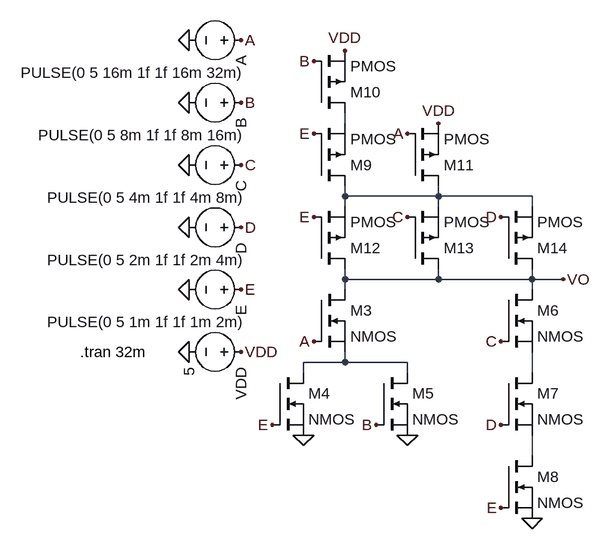
[diagram p0: schematic 21-16-11-a-1.asc]
21-16-11-a-1.asc, the LTspice schematic file:
Version 4
SHEET 1 1076 680
WIRE 640 -96 640 -112
WIRE 640 16 640 0
WIRE 784 16 784 0
WIRE 784 16 640 16
WIRE 928 16 784 16
WIRE 640 32 640 16
WIRE 784 32 784 16
WIRE 928 32 928 16
WIRE 640 144 640 128
WIRE 784 144 784 128
WIRE 784 144 640 144
WIRE 928 144 928 128
WIRE 928 144 784 144
WIRE 976 144 928 144
WIRE 640 160 640 144
WIRE 928 160 928 144
WIRE 640 272 640 256
WIRE 640 272 576 272
WIRE 736 272 640 272
WIRE 576 288 576 272
WIRE 736 288 736 272
WIRE 928 288 928 256
WIRE 928 416 928 384
FLAG 400 160 0
FLAG 480 160 E
FLAG 400 256 0
FLAG 480 256 VDD
FLAG 880 240 C
FLAG 880 368 D
FLAG 592 240 A
FLAG 688 368 B
FLAG 576 384 0
FLAG 736 384 0
FLAG 928 512 0
FLAG 880 48 D
FLAG 736 48 C
FLAG 784 -96 VDD
FLAG 592 -192 B
FLAG 736 -80 A
FLAG 400 64 0
FLAG 480 64 D
FLAG 400 -32 0
FLAG 480 -32 C
FLAG 400 -128 0
FLAG 480 -128 B
FLAG 400 -224 0
FLAG 480 -224 A
FLAG 976 144 VO
FLAG 640 -208 VDD
FLAG 880 496 E
FLAG 528 368 E
FLAG 592 48 E
FLAG 592 -80 E
SYMBOL voltage 496 160 R90
WINDOW 3 50 11 VRight 2
WINDOW 123 0 0 Left 0
WINDOW 39 0 0 Left 0
SYMATTR Value PULSE(0 5 1m 1f 1f 1m 2m)
SYMATTR InstName E
SYMBOL voltage 496 256 R90
WINDOW 123 0 0 Left 0
WINDOW 39 0 0 Left 0
SYMATTR InstName VDD
SYMATTR Value 5
SYMBOL nmos 592 160 R0
SYMATTR InstName M3
SYMBOL nmos 528 288 R0
SYMATTR InstName M4
SYMBOL nmos 688 288 R0
SYMATTR InstName M5
SYMBOL nmos 880 160 R0
SYMATTR InstName M6
SYMBOL nmos 880 288 R0
SYMATTR InstName M7
SYMBOL nmos 880 416 R0
SYMATTR InstName M8
SYMBOL pmos 592 0 M180
SYMATTR InstName M9
SYMBOL pmos 592 -112 M180
SYMATTR InstName M10
SYMBOL pmos 736 0 M180
SYMATTR InstName M11
SYMBOL pmos 592 128 M180
SYMATTR InstName M12
SYMBOL pmos 736 128 M180
SYMATTR InstName M13
SYMBOL pmos 880 128 M180
SYMATTR InstName M14
SYMBOL voltage 496 64 R90
WINDOW 3 50 11 VRight 2
WINDOW 123 0 0 Left 0
WINDOW 39 0 0 Left 0
SYMATTR Value PULSE(0 5 2m 1f 1f 2m 4m)
SYMATTR InstName D
SYMBOL voltage 496 -32 R90
WINDOW 3 50 11 VRight 2
WINDOW 123 0 0 Left 0
WINDOW 39 0 0 Left 0
SYMATTR Value PULSE(0 5 4m 1f 1f 4m 8m)
SYMATTR InstName C
SYMBOL voltage 496 -128 R90
WINDOW 3 50 11 VRight 2
WINDOW 123 0 0 Left 0
WINDOW 39 0 0 Left 0
SYMATTR Value PULSE(0 5 8m 1f 1f 8m 16m)
SYMATTR InstName B
SYMBOL voltage 496 -224 R90
WINDOW 3 50 11 VRight 2
WINDOW 123 0 0 Left 0
WINDOW 39 0 0 Left 0
SYMATTR Value PULSE(0 5 16m 1f 1f 16m 32m)
SYMATTR InstName A
TEXT 232 256 Left 2 !.tran 32m

The netlist it stands for:
* 21-16-11-a-1.asc
V§E E 0 PULSE(0 5 1m 1f 1f 1m 2m)
VDD VDD 0 5
M3 VO A N003 N003 NMOS
M4 N003 E 0 0 NMOS
M5 N003 B 0 0 NMOS
M6 VO C N004 N004 NMOS
M7 N004 D N005 N005 NMOS
M8 N005 E 0 0 NMOS
M9 N002 E N001 N001 PMOS
M10 N001 B VDD VDD PMOS
M11 N002 A VDD VDD PMOS
M12 VO E N002 N002 PMOS
M13 VO C N002 N002 PMOS
M14 VO D N002 N002 PMOS
V§D D 0 PULSE(0 5 2m 1f 1f 2m 4m)
V§C C 0 PULSE(0 5 4m 1f 1f 4m 8m)
V§B B 0 PULSE(0 5 8m 1f 1f 8m 16m)
V§A A 0 PULSE(0 5 16m 1f 1f 16m 32m)
.model NMOS NMOS
.model PMOS PMOS
.lib standard.mos
.tran 32m
.backanno
.end